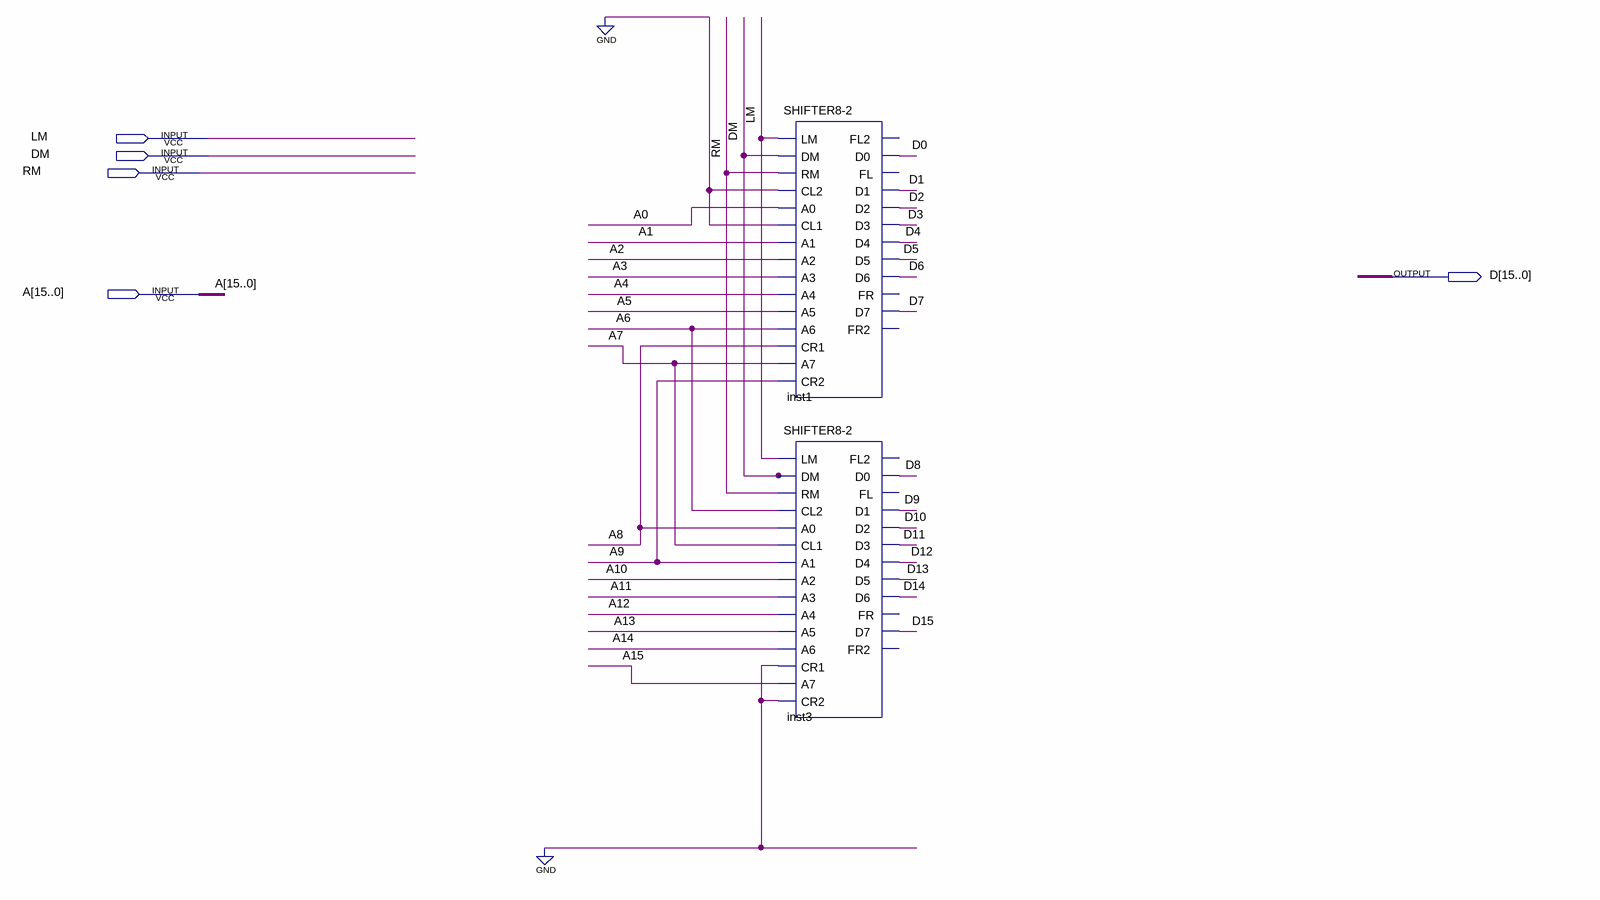
[diagram p0: schematic sheet]
// Quartus schematic SHIFTER16-2=B.bdf as structural Verilog: 2 symbols, 5 pins
module \SHIFTER16-2=B  (
  input  LM,
  input  DM,
  input  RM,
  input  [15:0] A,
  output [15:0] D
);

  \SHIFTER8-2  inst1 (
    .LM(LM), .DM(DM), .RM(RM), .CL2(1'b0), .A0(A[0]), .CL1(1'b0), .A1(A[1]), .A2(A[2]), .A3(A[3]), .A4(A[4]),
    .A5(A[5]), .A6(A[6]), .CR1(A[8]), .A7(A[7]), .CR2(A[9]), .D0(D[0]), .D1(D[1]), .D2(D[2]), .D3(D[3]),
    .D4(D[4]), .D5(D[5]), .D6(D[6]), .D7(D[7]));  // open: FL2, FL, FR, FR2
  \SHIFTER8-2  inst3 (
    .LM(LM), .DM(DM), .RM(RM), .CL2(A[6]), .A0(A[8]), .CL1(A[7]), .A1(A[9]), .A2(A[10]), .A3(A[11]),
    .A4(A[12]), .A5(A[13]), .A6(A[14]), .CR1(1'b0), .A7(A[15]), .CR2(1'b0), .D0(D[8]), .D1(D[9]), .D2(D[10]),
    .D3(D[11]), .D4(D[12]), .D5(D[13]), .D6(D[14]), .D7(D[15]));  // open: FL2, FL, FR, FR2
endmodule
